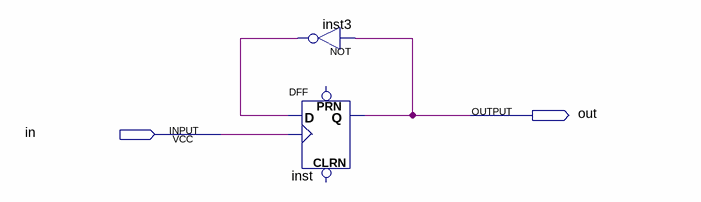
[diagram p0: schematic sheet]
// Quartus schematic divisor2.bdf as structural Verilog: 2 symbols, 2 pins
module divisor2 (
  input  in,
  output out
);

  wire inst3_out;

  not inst3 (inst3_out, out);
  DFF inst (.CLK(in), .D(inst3_out), .Q(out));  // open: CLRN, PRN
endmodule
